# EAGLE design darpa-power-distribution (EAGLE 9.3.2)

## Sheet 1 of 2
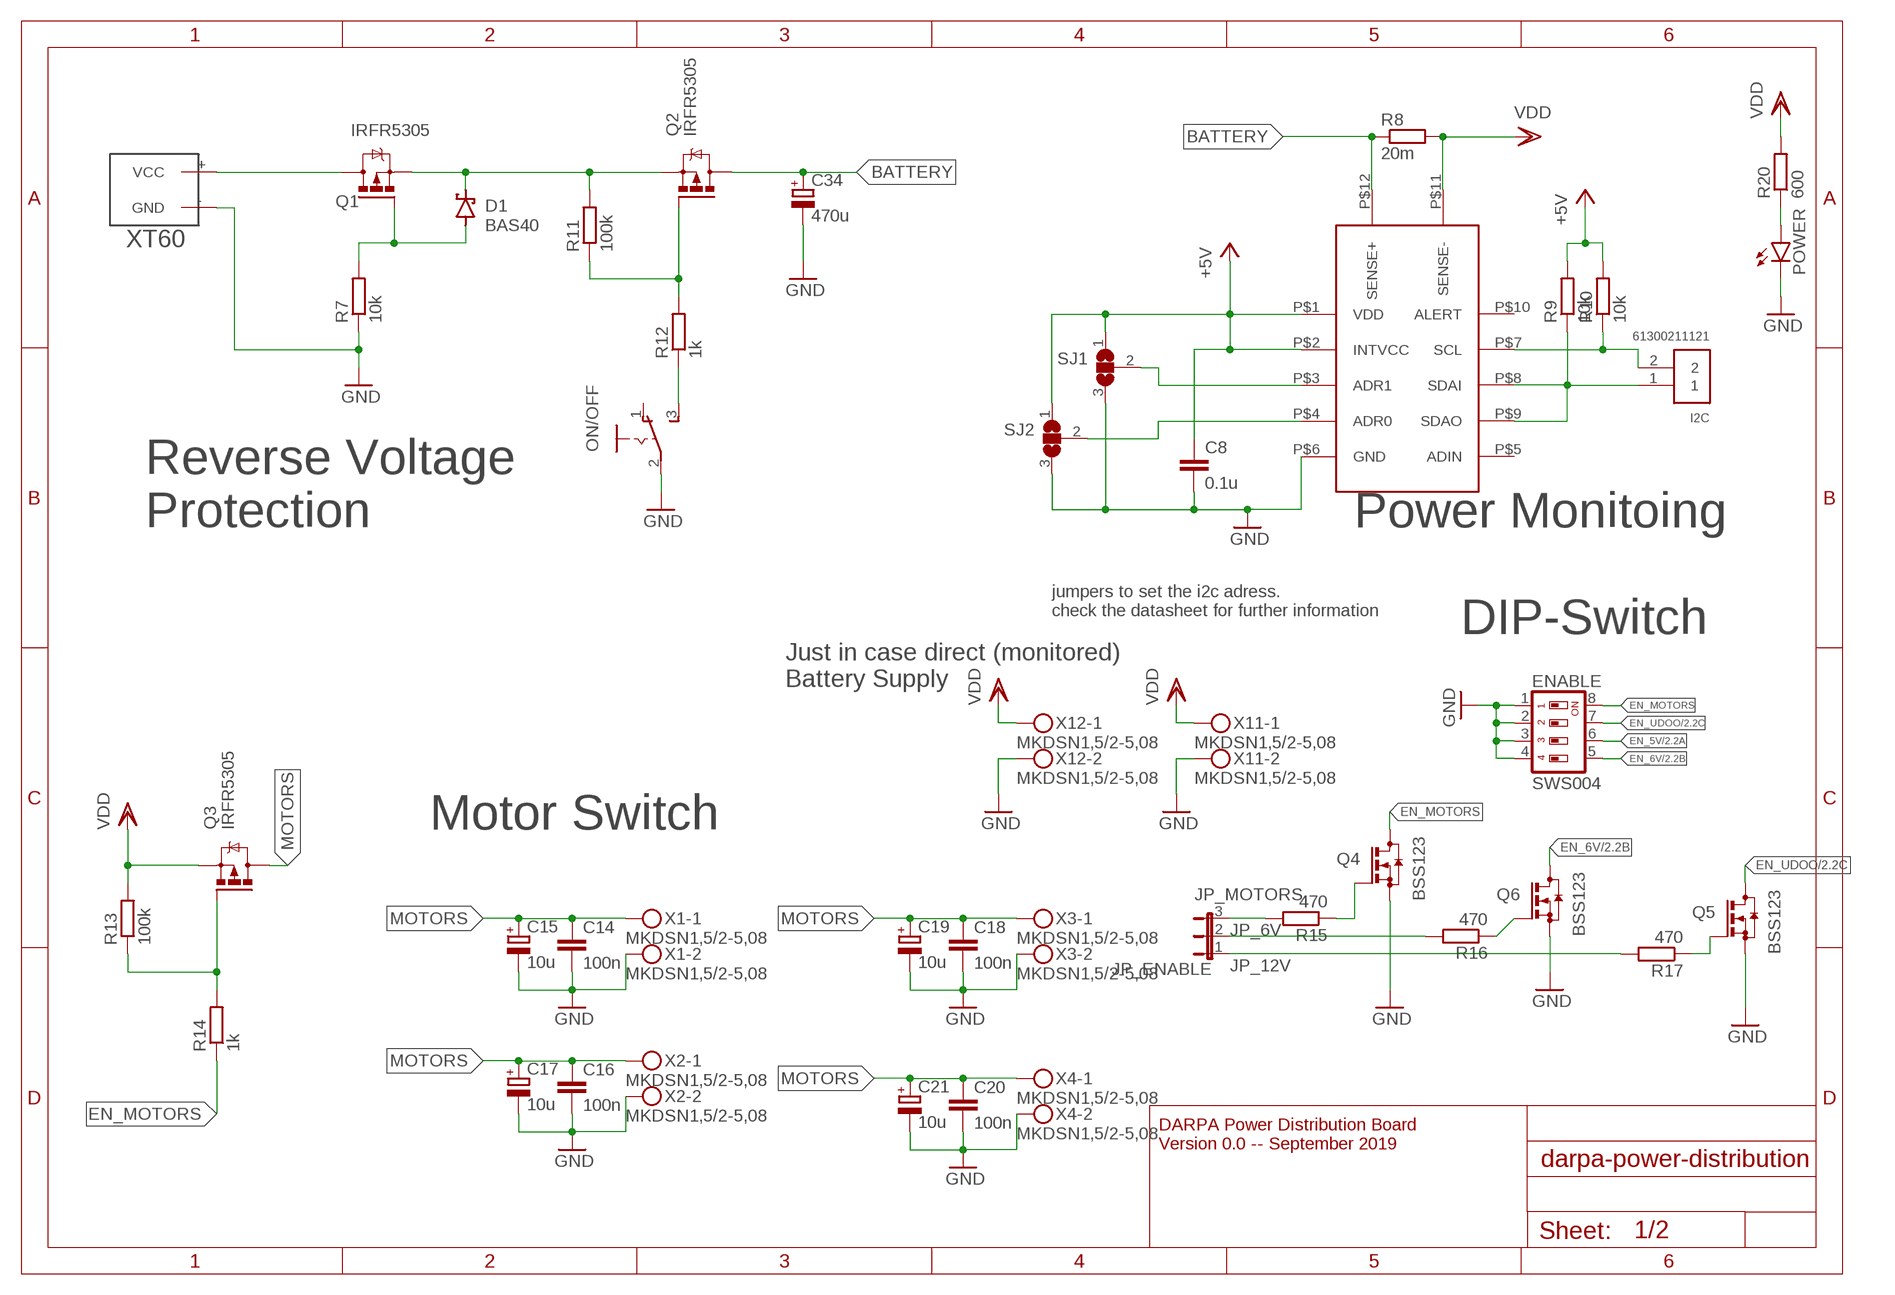
[diagram p0: schematic, sheet 1]
FRAME2 (A4L-LOC): REV: 0.0

### Parts
C8  0.1u  C-EUC0805K  [C0805K]
C14  100n  C-EUC0805K  [C0805K]
C15  10u  CPOL-EUE1.8-4  [E1,8-4]
C16  100n  C-EUC0805K  [C0805K]
C17  10u  CPOL-EUE1.8-4  [E1,8-4]
C18  100n  C-EUC0805K  [C0805K]
C19  10u  CPOL-EUE1.8-4  [E1,8-4]
C20  100n  C-EUC0805K  [C0805K]
C21  10u  CPOL-EUE1.8-4  [E1,8-4]
C34  470u  CPOL-EUE7.5-16  [E7,5-16]
D1  BAS40  [SOT23]
ENABLE  SWS004  [SMS-004]
I2C  61300211121  [61300211121]
JP_ENABLE  JP2E  [JP2]
ON/OFF  M251  [M251]
POWER  LEDSML0805  [SML0805]
Q1  IRFR5305  [D-PAK_TO252AA]
Q2  IRFR5305  [D-PAK_TO252AA]
Q3  IRFR5305  [D-PAK_TO252AA]
Q4  BSS123  [SOT23]
Q5  BSS123  [SOT23]
Q6  BSS123  [SOT23]
R7  10k  R-EU_R0805  [R0805]
R8  20m  R-EU_0613/15  [P0613/15]
R9  10k  R-EU_R0805  [R0805]
R10  10k  R-EU_R0805  [R0805]
R11  100k  R-EU_R0805  [R0805]
R12  1k  R-EU_R0805  [R0805]
R13  100k  R-EU_R0805  [R0805]
R14  1k  R-EU_R0805  [R0805]
R15  470  R-EU_R0805  [R0805]
R16  470  R-EU_R0805  [R0805]
R17  470  R-EU_R0805  [R0805]
R20  600  R-EU_R0805  [R0805]
SJ1  SJ2W  [SJ_2]
SJ2  SJ2W  [SJ_2]
U$3  LTC2945  [LTC2945]
U$4  XT60  [XT60]
X1  MKDSN1,5/2-5,08  [MKDSN1,5/2-5,08]
X2  MKDSN1,5/2-5,08  [MKDSN1,5/2-5,08]
X3  MKDSN1,5/2-5,08  [MKDSN1,5/2-5,08]
X4  MKDSN1,5/2-5,08  [MKDSN1,5/2-5,08]
X11  MKDSN1,5/2-5,08  [MKDSN1,5/2-5,08]
X12  MKDSN1,5/2-5,08  [MKDSN1,5/2-5,08]

### Nets
+5V: C8.1 R9.2 R10.2 SJ1.1 SJ2.1 U$3.P$1(VDD) U$3.P$2(INTVCC) ; also sheet 2
BATTERY: C34.+ Q2.4(D) R8.1 U$3.P$12(SENSE+)
EN_5V: ENABLE.6 ; also sheet 2
EN_6V: ENABLE.5 Q6.3(D) ; also sheet 2
EN_MOTORS: ENABLE.8 Q4.3(D) R14.1
EN_UDOO: ENABLE.7 Q5.3(D) ; also sheet 2
GND: C8.2 C14.2 C15.- C16.2 C17.- C18.2 C19.- C20.2 C21.- C34.- ENABLE.1 ENABLE.2 ENABLE.3 ENABLE.4 ON/OFF.2(P) POWER.C Q4.2(S) Q5.2(S) Q6.2(S) R7.1 SJ1.3 SJ2.3 U$3.P$6(GND) U$4.-(GND) X1.2 X2.2 X3.2 X4.2 X11.2 X12.2 ; also sheet 2
JP_6V: JP_ENABLE.2 R16.2
JP_12V: JP_ENABLE.1 R17.2
JP_MOTORS: JP_ENABLE.3 R15.2
MOTORS: C14.1 C15.+ C16.1 C17.+ C18.1 C19.+ C20.1 C21.+ Q3.4(D) X1.1 X2.1 X3.1 X4.1
N$6: D1.1(A) Q1.1(G) R7.2
N$9: SJ1.2 U$3.P$3(ADR1)
N$10: SJ2.2 U$3.P$4(ADR0)
N$11: Q2.1(G) R11.1 R12.2
N$12: D1.3(C) Q1.3(S) Q2.3(S) R11.2
N$13: Q3.1(G) R13.1 R14.2
N$14: ON/OFF.3(S) R12.1
N$15: Q1.4(D) U$4.+(VCC)
N$16: Q5.1(G) R17.1
N$19: Q4.1(G) R15.1
N$23: Q6.1(G) R16.1
N$27: POWER.A R20.1
SCL: I2C.2 R10.1 U$3.P$7(SCL)
SDA: I2C.1 R9.1 U$3.P$8(SDAI) U$3.P$9(SDAO)
VDD: Q3.3(S) R8.2 R13.2 R20.2 U$3.P$11(SENSE-) X11.1 X12.1 ; also sheet 2
Unconnected: ON/OFF.1(O) U$3.P$5(ADIN) U$3.P$10(ALERT)

### Notes on the sheet
- Reverse Voltage 
  Protection
- Power Monitoing
- jumpers to set the i2c adress.
  check the datasheet for further information
- DIP-Switch
- Just in case direct (monitored) 
  Battery Supply
- Motor Switch
- DARPA Power Distribution Board
  Version 0.0 -- September 2019

## Sheet 2 of 2
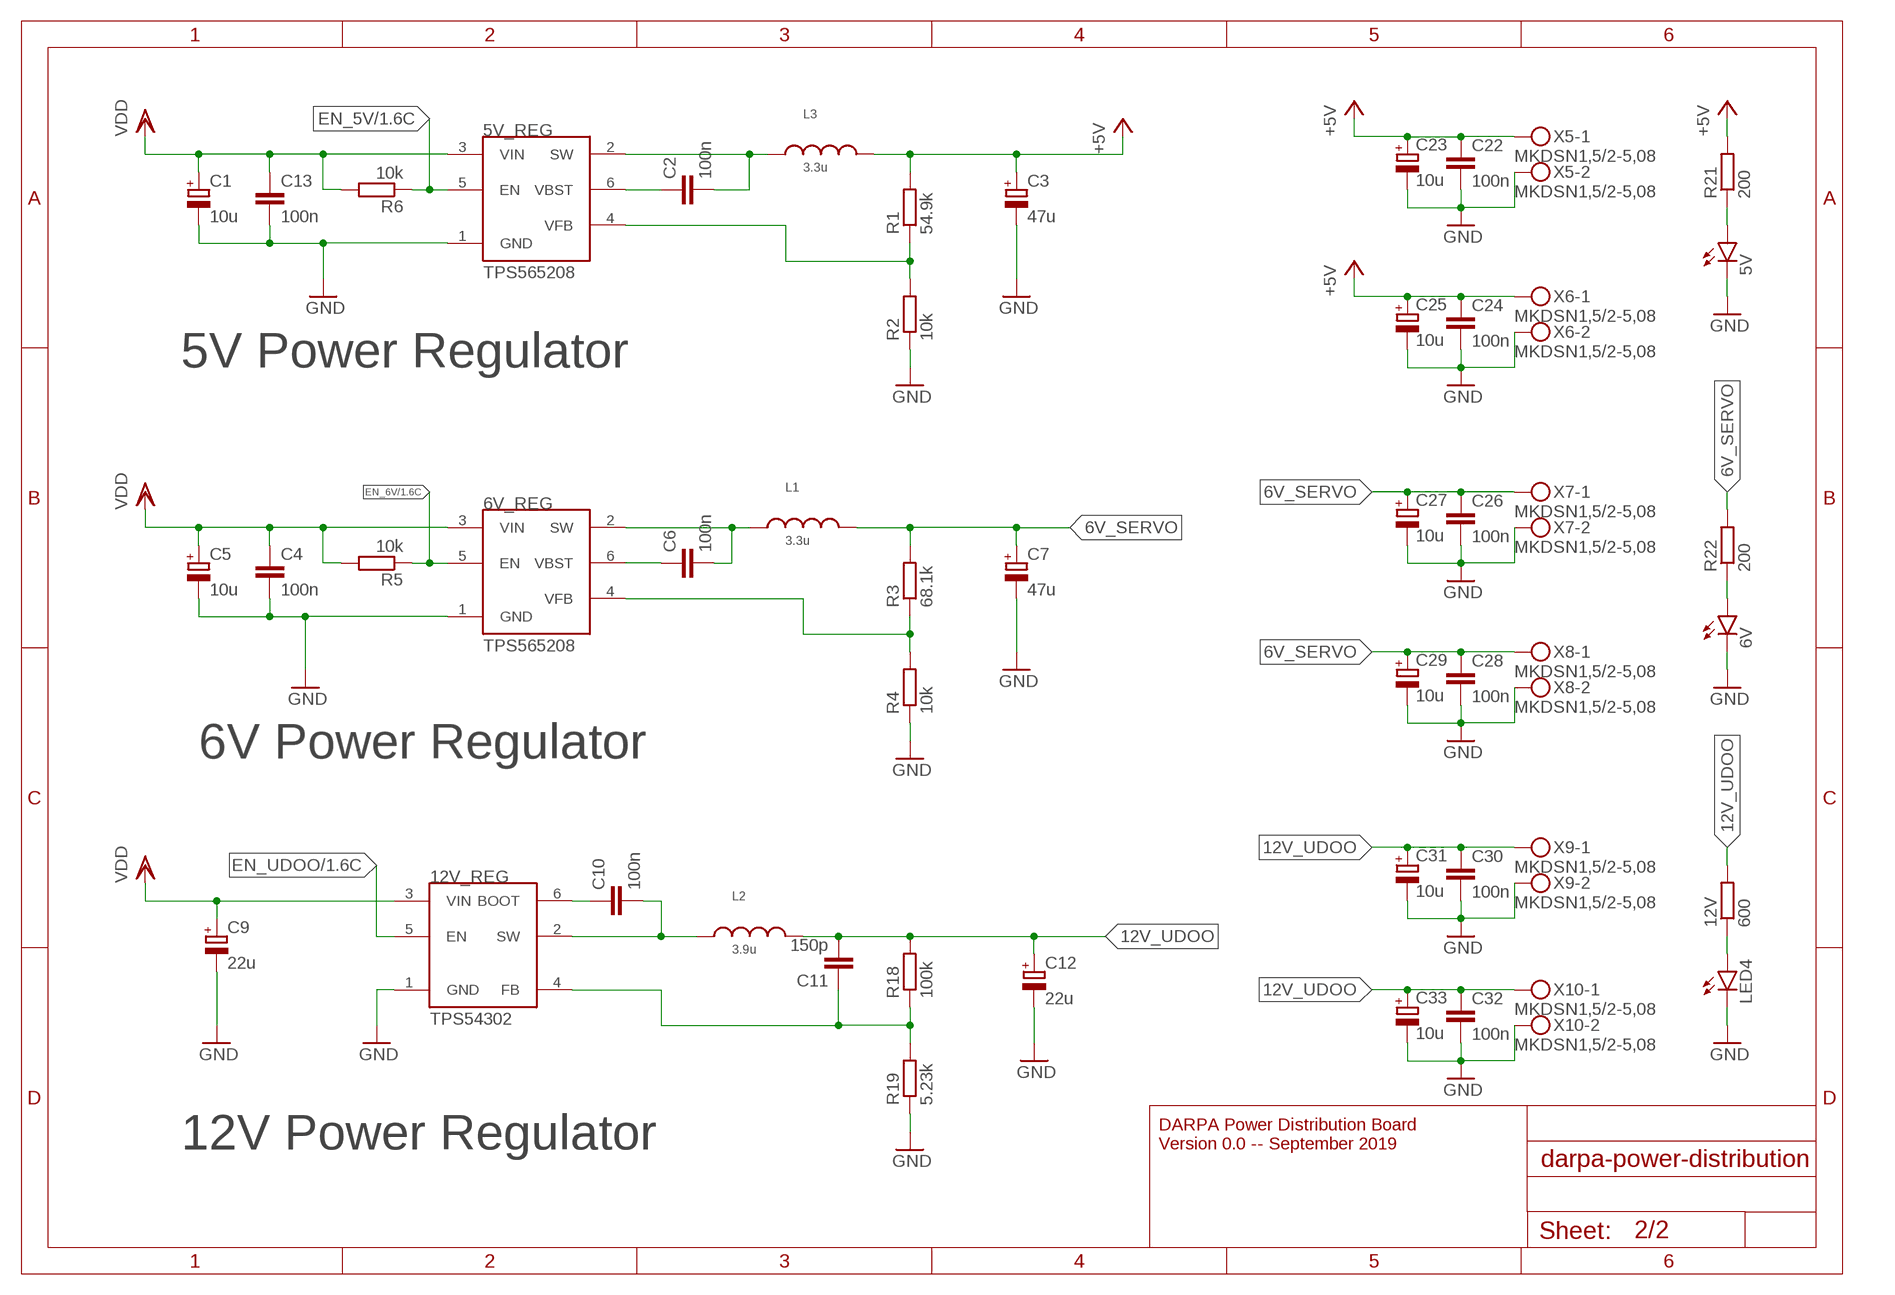
[diagram p1: schematic, sheet 2]

### Parts
5V  LEDSML0805  [SML0805]
5V_REG  TPS565208  [SOT23-6]
6V  LEDSML0805  [SML0805]
6V_REG  TPS565208  [SOT23-6]
12V  600  R-EU_R0805  [R0805]
12V_REG  TPS54302  [SOT23-6]
C1  10u  CPOL-EUE1.8-4  [E1,8-4]
C2  100n  C-EUC0805K  [C0805K]
C3  47u  CPOL-EUE2.5-6  [E2,5-6]
C4  100n  C-EUC0805K  [C0805K]
C5  10u  CPOL-EUE1.8-4  [E1,8-4]
C6  100n  C-EUC0805K  [C0805K]
C7  47u  CPOL-EUE2.5-6  [E2,5-6]
C9  22u  CPOL-EUE2.5-6  [E2,5-6]
C10  100n  C-EUC0805K  [C0805K]
C11  150p  C-EUC0805K  [C0805K]
C12  22u  CPOL-EUE2.5-6  [E2,5-6]
C13  100n  C-EUC0805K  [C0805K]
C22  100n  C-EUC0805K  [C0805K]
C23  10u  CPOL-EUE1.8-4  [E1,8-4]
C24  100n  C-EUC0805K  [C0805K]
C25  10u  CPOL-EUE1.8-4  [E1,8-4]
C26  100n  C-EUC0805K  [C0805K]
C27  10u  CPOL-EUE1.8-4  [E1,8-4]
C28  100n  C-EUC0805K  [C0805K]
C29  10u  CPOL-EUE1.8-4  [E1,8-4]
C30  100n  C-EUC0805K  [C0805K]
C31  10u  CPOL-EUE1.8-4  [E1,8-4]
C32  100n  C-EUC0805K  [C0805K]
C33  10u  CPOL-EUE1.8-4  [E1,8-4]
L1  3.3u  WE-CHSA_1011_7843330330  [WE-CHSA_1011]
L2  3.9u  WE-CHSA_1011_7843330330  [WE-CHSA_1011]
L3  3.3u  WE-CHSA_1011_7843330330  [WE-CHSA_1011]
LED4  LEDSML0805  [SML0805]
R1  54.9k  R-EU_R0805  [R0805]
R2  10k  R-EU_R0805  [R0805]
R3  68.1k  R-EU_R0805  [R0805]
R4  10k  R-EU_R0805  [R0805]
R5  10k  R-EU_R0805  [R0805]
R6  10k  R-EU_R0805  [R0805]
R18  100k  R-EU_R0805  [R0805]
R19  5.23k  R-EU_R0805  [R0805]
R21  200  R-EU_R0805  [R0805]
R22  200  R-EU_R0805  [R0805]
X5  MKDSN1,5/2-5,08  [MKDSN1,5/2-5,08]
X6  MKDSN1,5/2-5,08  [MKDSN1,5/2-5,08]
X7  MKDSN1,5/2-5,08  [MKDSN1,5/2-5,08]
X8  MKDSN1,5/2-5,08  [MKDSN1,5/2-5,08]
X9  MKDSN1,5/2-5,08  [MKDSN1,5/2-5,08]
X10  MKDSN1,5/2-5,08  [MKDSN1,5/2-5,08]

### Nets
6V_SERVO: C7.+ C26.1 C27.+ C28.1 C29.+ L1.2 R3.2 R22.2 X7.1 X8.1
12V_UDOO: 12V.2 C11.2 C12.+ C30.1 C31.+ C32.1 C33.+ L2.2 R18.2 X9.1 X10.1
+5V: C3.+ C22.1 C23.+ C24.1 C25.+ L3.2 R1.2 R21.2 X5.1 X6.1 ; also sheet 1
EN_5V: 5V_REG.5(EN) R6.1 ; also sheet 1
EN_6V: 6V_REG.5(EN) R5.1 ; also sheet 1
EN_UDOO: 12V_REG.5(EN) ; also sheet 1
GND: 5V.C 5V_REG.1(GND) 6V.C 6V_REG.1(GND) 12V_REG.1(GND) C1.- C3.- C4.2 C5.- C7.- C9.- C12.- C13.2 C22.2 C23.- C24.2 C25.- C26.2 C27.- C28.2 C29.- C30.2 C31.- C32.2 C33.- LED4.C R2.1 R4.1 R19.1 X5.2 X6.2 X7.2 X8.2 X9.2 X10.2 ; also sheet 1
N$1: 5V_REG.4(VFB) R1.1 R2.2
N$2: 5V_REG.6(VBST) C2.1
N$3: 5V_REG.2(SW) C2.2 L3.1
N$4: 6V_REG.2(SW) C6.2 L1.1
N$5: 6V_REG.6(VBST) C6.1
N$7: 6V_REG.4(VFB) R3.1 R4.2
N$17: 12V_REG.6(BOOT) C10.1
N$18: 12V_REG.2(SW) C10.2 L2.1
N$20: 12V_REG.4(FB) C11.1 R18.1 R19.2
N$28: 5V.A R21.1
N$29: 6V.A R22.1
N$30: 12V.1 LED4.A
VDD: 5V_REG.3(VIN) 6V_REG.3(VIN) 12V_REG.3(VIN) C1.+ C4.1 C5.+ C9.+ C13.1 R5.2 R6.2 ; also sheet 1

### Notes on the sheet
- 5V Power Regulator
- 6V Power Regulator
- 12V Power Regulator
- DARPA Power Distribution Board
  Version 0.0 -- September 2019

## Library data of the parts
5V 6V LED4 POWER = led:LED: LED OSRAM: - CHIPLED LG R971, LG N971, LY N971, LG Q971, LY Q971, LO R971, LY R971 LH N974, LH R974 LS Q976, LO Q976, LY Q976 LO Q996 - Hyper CHIPLED LW Q18S LB Q993, LB Q99A, LB R99A - SideLED LS A670, LO A670, LY A670, LG A670, LP A670 LB A673, LV A673, LT A673, LW A673 LH A674 LY A675 LS A676, LA A676, LO A676, LY A676, LW A676 LS A679, LY A679, LG A679 - Hyper Micro SIDELED® LS Y876, LA Y876, LO Y876, LY Y876 LT Y87S - SmartLED LW L88C, LW L88S LB L89C, LB L89S, LG L890 LS L89K, LO L89K, LY L89K LS L896, LA L896, LO L896, LY L896 - TOPLED LS T670, LO T670, LY T670, LG T670, LP T670 LSG T670, LSP T670, LSY T670, LOP T670, LYG T670 LG T671, LOG T671, LSG T671 LB T673, LV T673, LT T673, LW T673 LH T674 LS T676, LA T676, LO T676, LY T676, LB T676, LH T676, LSB T676, LW T676 LB T67C, LV T67C, LT T67C, LS T67K, LO T67K, LY T67K, LW E67C LS E67B, LA E67B, LO E67B, LY E67B, LB E67C, LV E67C, LT E67C LW T67C LS T679, LY T679, LG T679 LS T770, LO T770, LY T770, LG T770, LP T770 LB T773, LV T773, LT T773, LW T773 LH T774 LS E675, LA E675, LY E675, LS T675 LS T776, LA T776, LO T776, LY T776, LB T776 LHGB T686 LT T68C, LB T68C - Hyper Mini TOPLED® LB M676 - Mini TOPLED Santana® LG M470 LS M47K, LO M47K, LY M47K Source: http://www.osram.convergy.de LUXEON: - LUMILED® LXK2-PW12-R00, LXK2-PW12-S00, LXK2-PW14-U00, LXK2-PW14-V00 LXK2-PM12-R00, LXK2-PM12-S00, LXK2-PM14-U00 LXK2-PE12-Q00, LXK2-PE12-R00, LXK2-PE12-S00, LXK2-PE14-T00, LXK2-PE14-U00 LXK2-PB12-K00, LXK2-PB12-L00, LXK2-PB12-M00, LXK2-PB14-N00, LXK2-PB14-P00, LXK2-PB14-Q00 LXK2-PR12-L00, LXK2-PR12-M00, LXK2-PR14-Q00, LXK2-PR14-R00 LXK2-PD12-Q00, LXK2-PD12-R00, LXK2-PD12-S00 LXK2-PH12-R00, LXK2-PH12-S00 LXK2-PL12-P00, LXK2-PL12-Q00, LXK2-PL12-R00 Source: www.luxeon.com KINGBRIGHT: KA-3528ASYC Source: www.kingbright.com
5V_REG 6V_REG = TPSxxxxxx-buck-regulators:TPS565208
12V R1-R22 = rcl:R-EU_: RESISTOR, European symbol; SPICEPREFIX: R
12V_REG = TPSxxxxxx-buck-regulators:TPS54302
C1 C3 C5 C7 C9 C12 C15 C17 C19 C21 C23 C25 C27 C29 C31 C33 C34 = rcl:CPOL-EU: POLARIZED CAPACITOR, European symbol; SPICEPREFIX: C
C2 C4 C6 C8 C10 C11 C13 C14 C16 C18 C20 C22 C24 C26 C28 C30 C32 = rcl:C-EU: CAPACITOR, European symbol; SPICEPREFIX: C
D1 = diode:BAS40: Silicon Schottky Diodes General-purpose diode for high-speed switching
ENABLE = smd-special:SWS004: SMD Dip Switch 4 pol.
I2C = Headers:61300211121: CONN HEADER VERT 2POS 2.54MM Manufacturer's datasheet <https://katalog.we-online.de/em/datasheet/6130xx11121.pdf>; CREATED_BY: PCBLayout.com; DIGI_KEY_PART_NUMBER: 732-5315-ND; MANUFACTURER: Wurth Electronics Inc.; MPN: 61300211121
JP_ENABLE = jumper:JP2E: JUMPER
L1-L3 = Wurth_Elektronik_Passive_rev19e:WE-CHSA_1011: WE-CHSA SMD High Current Inductor Characteristics Magnetically shielded rod- core inductor Operating temperature: -55°C to +150°C Current capability up to 28A Ideal coplanarity due to embedded solder pads Applications HFilter choke for motor electronics Car infotainment Multimedia applications <http://katalog.we-online.de/media/images/v2/Family_WE-CHSA_78433xxxx_Gruppe_4C.jpg> Details see: http://katalog.we-online.de/en/pbs/WE-CHSA Created by Yingchun,Shan 2017-12-06 2017 (C) Wurth Elektronik; WE-NUMBER: 7843330330/3,3uH
ON/OFF = switch:M251: SLIDING SWITCH Mors, distributor Buerklin, 11G702
Q1-Q3 = transistor-power:IRF?5305: HEXFET Power MOSFET Source: http://www.irf.com/product-info/datasheets/data/irfr5305pbf.pdf
Q4-Q6 = transistor-small-signal:BSS123: N-CHANNEL MOS FET
SJ1 SJ2 = jumper:SJ2W: SMD solder JUMPER
U$3 = LTC2945:LTC2945
U$4 = XT60:XT60: XT60
X1-X12 = con-phoenix-508:MKDSN1,5/2-5,08: MKDSN 1,5/ 2-5,08 Printklemme Nennstrom: 13,5 A Nennspannung: 250 V Rastermaß: 5,08 mm Polzahl: 2 Anschlussart: Schraubanschluss Montage: Löten Anschlussrichtung Leiter/Platine: 0 ° Artikelnummer: 1729128 Source: http://eshop.phoenixcontact.com .. 1729128.pdf

## Board
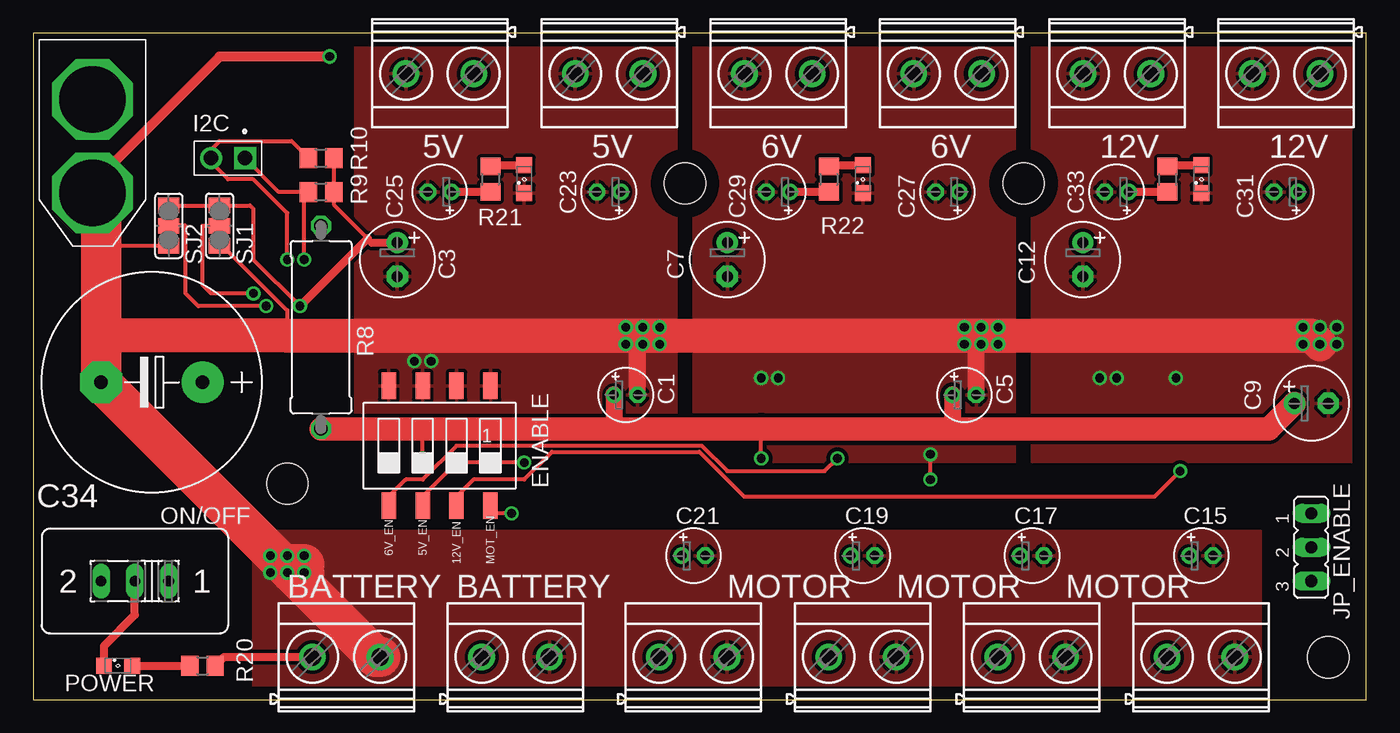
[diagram p2: board, top side]
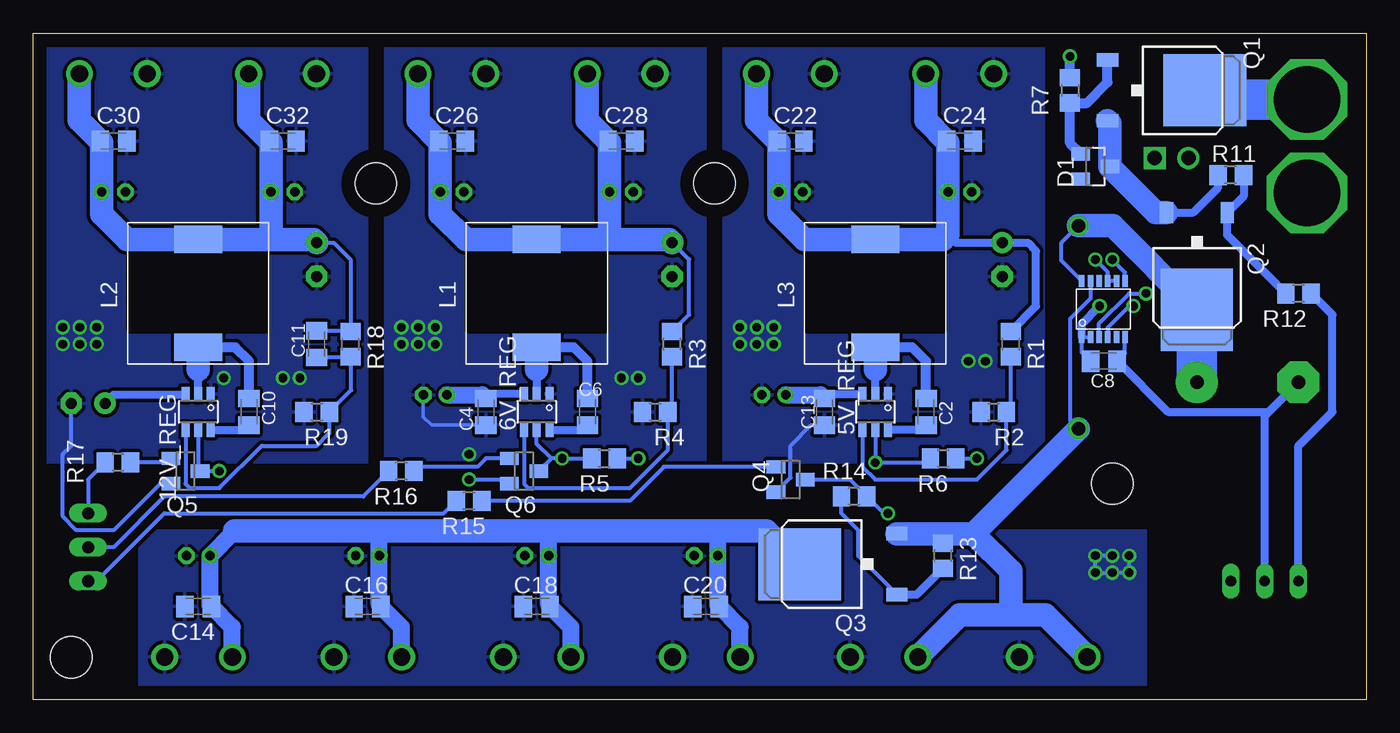
[diagram p3: board, bottom side, seen from below]

Size 100 x 50 mm. Coordinates in mm from the lower left corner, seen from the top.
Outline: 0,0 100,0 100,50 0,50 0,0
Copper layers (1*16): Top 0.035mm / dielectric 1.5mm / Bottom 0.035mm
Design rules "breakout *": minimum track width 10mil, minimum drill 24mil, track to track 6mil, track to pad 6mil, pad to pad 6mil, via to via 8mil, smd to smd 6mil, copper to edge 40mil, drill to drill 8mil, minimum pad ring 10mil, minimum via ring 8mil, stop-mask expansion 4mil, vias tented up to drill 0mil, thermal gap 10mil
Holes 3.1 mm at 19.05,16.19 48.9,38.73 74.3,38.73 97.16,3.17

### Footprints (pad centres in the part's own frame; a part is rotated, then mirrored left to right if it is on the bottom)
SML0805 = smd 1.2 x 1.2: A 1.05,0; C -1.05,0
SOT23-6 = smd 0.6 x 1.05: 1 -0.95,-1.35; 2 0,-1.35; 3 0.95,-1.35; 4 0.95,1.35; 5 0,1.35; 6 -0.95,1.35
R0805 = smd 1.3 x 1.5: 1 -0.95,0; 2 0.95,0
E1,8-4 = drill 0.711 pad 1.168: + -0.889,0 | drill 0.711 pad 1.168 octagon: - 0.889,0
C0805K = smd 1.3 x 1.6: 1 -1,0; 2 1,0
E2,5-6 = drill 0.813 pad 1.6: + -1.27,0 | drill 0.813 pad 1.6 octagon: - 1.27,0
E7,5-16 = drill 1.016 pad 3.15: + -3.81,0 | drill 1.016 pad 3.15 octagon: - 3.81,0
SOT23 = smd 1 x 1.4: 1 -0.95,-1.1; 2 0.95,-1.1; 3 0,1.1
SMS-004 = smd 1.092 x 2.007: 1 -3.81,-4.496; 2 -1.27,-4.496; 3 1.27,-4.496; 4 3.81,-4.496; 5 3.81,4.496; 6 1.27,4.496; 7 -1.27,4.496; 8 -3.81,4.496
61300211121 = drill 1.1 square: 1 -1.27,0 | drill 1.1: 2 1.27,0
JP2 = drill 0.914 long: 1 -2.54,0; 2 0,0; 3 2.54,0
WE-CHSA_1011 = smd 2.05 x 3.6: 1 -4.05,0; 2 4.05,0
M251 = drill 0.813 long: 1 -2.54,0; 2 0,0; 3 2.54,0
D-PAK_TO252AA = smd 1 x 1.6: 1 -2.28,-4.8; 3 2.28,-4.8 | smd 5.4 x 6.2: 4 0,2.5
P0613/15 = drill 1.016 octagon: 1 -7.62,0; 2 7.62,0
SJ_2 = smd 1.168 x 1.6: 1 -1.524,0; 2 0,0; 3 1.524,0
LTC2945 = smd 0.42 x 0.9: P$1 0.25,0.55; P$2 0.9,0.55; P$3 1.55,0.55; P$4 2.2,0.55; P$5 2.85,0.55; P$6 3.5,0.55; P$7 3.5,4.75; P$8 2.85,4.75; P$9 2.2,4.75; P$10 1.55,4.75; P$11 0.9,4.75; P$12 0.25,4.75
XT60 = drill 5 octagon: + 4.5,0; - 11.5,0
MKDSN1,5/2-5,08 = drill 1.3 pad 2: 1 -2.561,0.025; 2 2.519,0.025

### Placement (x,y rotation side)
5V  36.83,39.05 90 top
5V_REG  36.83,21.59 180 bottom
6V  62.23,39.05 90 top
6V_REG  62.23,21.59 180 bottom
12V  85.09,39.05 270 top
12V_REG  87.63,21.59 180 bottom
C1  44.45,22.86 0 top
C2  33.02,21.59 90 bottom
C3  27.3,33.02 270 top
C4  66.04,21.59 270 bottom
C5  69.85,22.86 0 top
C6  58.42,21.59 90 bottom
C7  52.07,33.02 270 top
C8  19.68,25.4 0 bottom
C9  95.89,22.23 0 top
C10  83.82,21.59 90 bottom
C11  78.74,26.67 90 bottom
C12  78.74,33.02 270 top
C13  40.64,21.59 270 bottom
C14  87.63,6.99 180 bottom
C15  87.63,10.79 0 top
C16  74.93,6.99 180 bottom
C17  74.93,10.79 0 top
C18  62.23,6.99 180 bottom
C19  62.23,10.79 0 top
C20  49.53,6.99 180 bottom
C21  49.53,10.79 0 top
C22  43.18,41.91 0 bottom
C23  43.18,38.1 180 top
C24  30.48,41.91 0 bottom
C25  30.48,38.1 180 top
C26  68.58,41.91 0 bottom
C27  68.58,38.1 180 top
C28  55.88,41.91 0 bottom
C29  55.88,38.1 180 top
C30  93.98,41.91 0 bottom
C31  93.98,38.1 180 top
C32  81.28,41.91 0 bottom
C33  81.28,38.1 180 top
C34  8.89,23.81 180 top
D1  20.32,40.01 270 bottom
ENABLE  30.48,19.05 180 top
I2C  14.61,40.64 180 top
JP_ENABLE  95.89,11.43 270 top
L1  62.23,30.48 90 bottom
L2  87.63,30.48 90 bottom
L3  36.83,30.48 90 bottom
LED4  87.63,39.05 90 top
ON/OFF  7.62,8.89 180 top
POWER  6.35,2.54 0 top
Q1  14.61,45.72 270 bottom
Q2  12.7,31.75 180 bottom
Q3  40.01,10.16 90 bottom
Q4  43.18,16.51 270 bottom
Q5  88.58,17.14 270 bottom
Q6  63.18,17.14 270 bottom
R1  26.67,26.67 90 bottom
R2  27.94,21.59 0 bottom
R3  52.07,26.67 90 bottom
R4  53.34,21.59 0 bottom
R5  57.15,18.1 0 bottom
R6  31.75,18.1 0 bottom
R7  22.23,45.72 270 bottom
R8  21.59,27.94 270 top
R9  21.59,38.1 0 top
R10  21.59,40.64 0 top
R11  10.16,39.37 180 bottom
R12  5.08,30.48 180 bottom
R13  31.75,10.79 90 bottom
R14  38.42,15.24 180 bottom
R15  67.31,14.92 180 bottom
R16  72.39,17.14 180 bottom
R17  93.66,17.78 180 bottom
R18  76.2,26.67 90 bottom
R19  78.74,21.59 0 bottom
R20  12.7,2.54 0 top
R21  34.29,39.05 270 top
R22  59.69,39.05 270 top
SJ1  13.97,35.56 270 top
SJ2  10.16,35.56 270 top
U$3  21.59,26.67 0 bottom
U$4  4.45,49.53 270 top
X1  87.63,3.17 0 top
X2  74.93,3.17 0 top
X3  62.23,3.17 0 top
X4  49.53,3.17 0 top
X5  43.18,46.99 180 top
X6  30.48,46.99 180 top
X7  68.58,46.99 180 top
X8  55.88,46.99 180 top
X9  93.98,46.99 180 top
X10  81.28,46.99 180 top
X11  36.2,3.17 0 top
X12  23.5,3.17 0 top

### Tracks (layer width: path | path; a pad name or v marks a point on that pad's centre or on a via)
6V_SERVO
  Top 0.61: C29.+ R22.2
  Bottom 0.305: R3.2 50.8,28.89 50.8,33.02 C7.+
  Bottom 1.778: C7.+ 52.31,34.53 57.15,34.53 | 57.15,34.53 L1.2 67.55,34.53 69.47,36.45 C27.+ 69.47,41.8 C26.1 71.14,43.47 X7.1 | 57.15,34.53 56.77,34.91 C29.+ 56.77,41.8 C28.1 58.44,43.47 X8.1
12V_UDOO
  Top 0.61: C33.+ 12V.2
  Bottom 0.305: C11.2 76.25,27.67 R18.2 76.2,33.02 77.47,34.29 C12.+
  Bottom 1.778: 82.55,34.53 L2.2 92.95,34.53 94.87,36.45 C31.+ 94.87,41.8 C30.1 96.54,43.47 X9.1 | 82.55,34.53 78.98,34.53 C12.+ | 82.55,34.53 82.17,34.91 C33.+ 82.17,41.8 C32.1 83.84,43.47 X10.1
+5V  (via drill 0.65)
  Top 0.305: 25.4,34.29 25.08,34.61 22.54,37.15 R9.2 R10.2 | SJ2.1 SJ1.1 16.26,37.08 16.51,36.83 16.51,33.02 v20,29.53
  Top 0.61: v20,29.53 25.08,34.61 | C25.+ R21.2 | 25.4,34.29 C3.+
  Bottom 0.305: U$3.P$2 U$3.P$1 21.34,26.05 C8.1
  Bottom 0.61: R1.2 24.77,29.52 24.77,33.66 25.4,34.29 C3.+ 30.75,34.29 31.37,34.91 | U$3.P$1 21.34,28.19 v20,29.53
  Bottom 1.778: X6.1 33.04,43.47 C24.1 31.37,41.8 C25.+ 31.37,34.91 31.75,34.53 L3.2 42.15,34.53 44.07,36.45 C23.+ 44.07,41.8 C22.1 45.74,43.47 X5.1
BATTERY
  Bottom 0.305: U$3.P$12 22.86,32.94 22.86,34.29 R8.1
  Bottom 1.778: Q2.4 19.01,35.56 R8.1
  Bottom 3.048: C34.+ Q2.4
EN_5V  (via drill 0.65)
  Top 0.305: v36.83,17.78 31.75,17.78 29.21,15.24 ENABLE.6
  Bottom 0.305: 5V_REG.5 v36.83,17.78 33.02,17.78 R6.1
EN_6V  (via drill 0.65)
  Top 0.305: 26.67,15.24 27.94,16.51 29.21,16.51 31.75,19.05 50.16,19.05 52.07,17.14 59.37,17.14 v60.33,18.1
  Top 0.61: ENABLE.5 26.67,15.24
  Bottom 0.305: R5.1 v60.33,18.1 61.13,18.1 | 61.13,18.1 Q6.3 | 61.13,18.1 62.23,19.2 6V_REG.5
EN_MOTORS  (via drill 0.65)
  Top 0.305: v35.88,13.97 34.87,13.97 arc-90 ENABLE.8
  Bottom 0.305: Q4.3 38.73,16.51 R14.1 | R14.1 | v35.88,13.97 36.2,13.97 R14.1
EN_UDOO  (via drill 0.65)
  Top 0.305: ENABLE.7 31.75,15.24 33.02,16.51 36.83,16.51 38.91,18.59 49.98,18.59 53.33,15.24 84.14,15.24 v86.04,17.14
  Bottom 0.305: 12V_REG.5 87.63,17.29 Q5.3 v86.04,17.14
GND  (via drill 0.65)
  Top 0.305: SJ2.3 5.33,34.04 5.08,34.29 | SJ1.3 14.22,34.04 19.05,29.21 19.05,27.3 | v67.31,16.51 v67.31,18.4
  Top 0.61: POWER.C 5.3,4.03 7.62,6.35 ON/OFF.2
  Top 0.762: v22.23,48.26 13.97,48.26 4.45,38.73 U$4.-
  Top 1.27: C1.- 45.34,26.92 45.72,27.3 | C5.- 70.74,26.92 71.12,27.3
  Top 2.54: 5.71,27.3 19.05,27.3 45.72,27.3 71.12,27.3 95.89,27.3 v96.52,26.67
  Top 3.048: 5.08,27.94 C34.- 25.69,3.2 X12.2 | 5.08,27.94 5.08,34.29 5.08,37.4 U$4.- | 5.71,27.3 5.08,27.94 | 18.73,10.16 20.32,10.16 | 19.37,9.53 v20.32,9.53
  Bottom 0.254: C5.- 70.74,21.21 70.12,20.59 C4.2
  Bottom 0.305: C8.2 18.09,26 U$3.P$6 | v19.05,10.79 v20.32,10.79 v20.32,9.53 v19.05,9.53 v17.78,9.53 | 17.78,10.16 v17.78,10.79 | Q5.2 90.48,16.2 93.98,12.7 96.76,12.7 97.79,13.73 97.79,18.41 97.16,19.05 C9.- | Q4.2 43.18,16.66 43.18,19.05 41.64,20.59 C13.2 | v67.31,16.51 64.6,16.51 Q6.2
  Bottom 0.61: ON/OFF.2 7.62,21.27 C34.- 7.3,21.59 14.88,21.59 C8.2
  Bottom 0.762: R7.1 v22.23,48.26
  other vias: 44.45,27.94 45.72,27.94 46.99,27.94 46.99,26.67 45.72,26.67 44.45,26.67 69.85,27.94 71.12,27.94 72.39,27.94 72.39,26.67 71.12,26.67 69.85,26.67 95.25,27.94 96.52,27.94 97.79,27.94 97.79,26.67 95.25,26.67 28.57,25.4 29.84,25.4 54.61,24.13 55.88,24.13 80.01,24.13 81.28,24.13 85.72,24.13
  pour Bottom (isolate 0.254): 24.13,52.07 48.26,52.07 48.26,17.78 24.13,17.78
  pour Bottom (isolate 0.254): 49.53,52.07 73.66,52.07 73.66,17.78 49.53,17.78
  pour Bottom (isolate 0.254): 74.93,52.07 100.33,52.07 100.33,17.78 74.93,17.78
  pour Top (isolate 0.254): 24.13,52.07 48.26,52.07 48.26,17.78 24.13,17.78
  pour Top (isolate 0.305): 49.53,52.07 73.66,52.07 73.66,17.78 49.53,17.78
  pour Top (isolate 0.254): 74.93,52.07 100.33,52.07 100.33,17.78 74.93,17.78
  pour Top (isolate 0.254): 16.51,12.7 92.08,12.7 92.08,-1.27 16.51,-1.27
  pour Bottom (isolate 0.254): 16.51,-1.27 16.51,12.7 92.08,12.7 92.08,-1.27
JP_6V
  Bottom 0.305: R16.2 75.25,15.24 90.17,15.24 93.98,11.43 JP_ENABLE.2
JP_12V
  Bottom 0.305: R17.2 95.89,16.51 JP_ENABLE.1
JP_MOTORS
  Bottom 0.305: JP_ENABLE.3 95.25,8.89 90.17,13.97 69.21,13.97 R15.2
MOTORS
  Bottom 1.27: 48.9,12.66 48.64,12.41 C21.+ 48.64,7.1 C20.1 46.97,5.42 X4.1 | 61.59,12.66 61.34,12.41 C19.+ 61.34,7.1 C18.1 59.67,5.42 X3.1 | 74.3,12.66 74.04,12.41 C17.+ 74.04,7.1 C16.1 72.37,5.42 X2.1 | 84.88,12.66 C15.+ 86.74,7.1 C14.1 85.07,5.42 X1.1
  Bottom 1.778: 84.88,12.66 74.3,12.66 61.59,12.66 48.9,12.66 45.01,12.66 Q3.4
N$1
  Bottom 0.305: 5V_REG.4 37.78,19.05 37.78,18.73 37.78,17.46 36.83,16.51 29.21,16.51 26.99,18.73 R2.2 26.67,21.91 R1.1
N$2
  Bottom 0.61: C2.1 33.37,20.24 5V_REG.6
N$3
  Bottom 0.61: 5V_REG.2 36.83,24.77
  Bottom 0.762: C2.2 33.02,25.4 34.05,26.43 L3.1
  Bottom 1.778: 36.83,24.77 L3.1
N$4
  Bottom 0.61: 62.23,24.77 6V_REG.2
  Bottom 0.762: C6.2 58.42,25.4 59.45,26.43 L1.1
  Bottom 1.778: L1.1 62.23,24.77
N$5
  Bottom 0.61: 6V_REG.6 58.77,20.24 C6.1
N$6
  Bottom 0.762: Q1.1 19.41,46.32 20.95,44.77 R7.2 22.23,41.76 D1.1
N$7
  Bottom 0.305: R3.1 52.07,21.91 R4.2 52.39,18.73 55.24,15.88 62.87,15.88 63.18,16.19 6V_REG.4
N$9  (via drill 0.65)
  Top 0.305: v16.51,30.48 13.34,30.48 12.7,31.11 12.7,35.56 SJ1.2
  Bottom 0.305: U$3.P$3 20.04,28.22 17.78,30.48 v16.51,30.48
N$10  (via drill 0.65)
  Top 0.305: v17.46,29.53 12.38,29.53 11.43,30.48 11.43,35.56 SJ2.2
  Bottom 0.305: U$3.P$4 19.39,27.92 17.78,29.53 v17.46,29.53
N$11
  Bottom 0.61: R11.1 9.15,39.31 9.15,37.82 Q2.1 10.42,34.87 R12.2
N$12
  Bottom 0.61: Q2.3 12.98,36.55 11.11,38.42 R11.2
  Bottom 1.778: Q1.3 19.22,43.26 D1.3 15.77,36.55 Q2.3
N$13
  Bottom 0.305: R14.2 39.37,13.97 38.1,12.7 38.1,10.78 Q3.1
  Bottom 0.61: Q3.1 33.72,7.88 R13.1
N$14
  Bottom 0.61: ON/OFF.3 5.08,19.05 2.54,21.59 2.54,28.89 R12.1
N$15
  Bottom 3.048: Q1.4 11.41,45.03 U$4.+
N$16
  Bottom 0.305: Q5.1 90,17.78 R17.1
N$17
  Bottom 0.61: 12V_REG.6 84.17,20.24 C10.1
N$18
  Bottom 0.61: 12V_REG.2 87.63,24.13
  Bottom 0.762: 87.63,24.13 87.63,24.77 | C10.2 83.82,25.4 84.85,26.43 L2.1
  Bottom 1.778: 87.63,24.77 L2.1
N$19
  Bottom 0.305: Q4.1 52.7,17.46 55.23,14.92 R15.1
N$20
  Bottom 0.305: C11.1 76.25,25.67 R18.1 76.15,25.67 76.15,23.23 R19.2 77.79,20 78.74,19.05 82.87,19.05 86.04,15.88 88.27,15.88 88.58,16.19 12V_REG.4
N$23
  Bottom 0.305: Q6.1 66.04,18.09 66.67,17.46 71.12,17.46 R16.1
N$27
  Top 0.61: POWER.A R20.1
N$28
  Top 0.61: R21.1 34.39,40.1 5V.A
N$29
  Top 0.61: R22.1 59.79,40.1 6V.A
N$30
  Top 0.61: 12V.1 85.19,40.1 LED4.A
SCL  (via drill 0.65)
  Top 0.305: R10.1 19.37,41.91 13.97,41.91 13.34,41.27 I2C.2 13.34,40.32 14.61,39.05 16.51,39.05 19.05,36.51 v19.05,33.02
  Bottom 0.305: U$3.P$7 18.09,32.06 v19.05,33.02
SDA  (via drill 0.65)
  Top 0.305: v20.32,33.02 20.32,37.78 R9.1 18.41,38.1 I2C.1
  Bottom 0.305: U$3.P$8 U$3.P$9 19.39,32.09 v20.32,33.02
VDD  (via drill 0.65)
  Top 0.305: v29.21,18.1 29.21,20.32 | v54.61,18.1 54.61,20.32
  Top 0.61: R20.2 14.31,3.2 X12.1
  Top 1.27: C5.+ 68.96,20.7 68.58,20.32 | C1.+ 43.56,20.7 43.18,20.32
  Top 1.778: C9.+ 92.71,20.32 68.58,20.32 54.61,20.32 43.18,20.32 29.21,20.32 R8.2
  Bottom 0.305: U$3.P$11 20.69,30.11 22.23,28.57 22.23,20.95 R8.2 | R6.2 v29.21,18.1 | R5.2 v54.61,18.1
  Bottom 0.61: C4.1 65.69,22.94 6V_REG.3 | C13.1 40.29,22.94 5V_REG.3 | 12V_REG.3 88.66,22.86 93.98,22.86 C9.+ | R13.2 31.75,12.44
  Bottom 1.27: C5.+ 66.31,22.86 C4.1 | C1.+ 40.91,22.86 C13.1
  Bottom 1.778: X11.1 30.48,6.35 26.67,6.35 | X12.1 24.08,6.35 26.67,6.35 | Q3.3 31.75,12.44 29.47,12.44 | 29.47,12.44 26.67,9.64 26.67,6.35 | R8.2 29.47,12.44

### Text on the board
tNames: 5V | 5V | 6V | 6V | 12V | 12V | 6V_EN | 5V_EN | 12V_EN | MOT_EN | BATTERY | BATTERY | MOTOR | MOTOR | MOTOR